# Altium schematic sheet QPB-V1-BlockDiagram.SchDoc: QUAN POWER BOARD VERSION 1
size A4; PageSetup: Record=PageOptions|CenterHorizontal=True|CenterVertical=True|PrintScale=1.00|XCorrection=1.00|YCorrection=1.00|PrintKind=0|BorderSize=5000000|LeftOffset=0|BottomOffset=0|Orientation=2|PaperLength=1000|PaperWidth=1000|Scale=100|PaperSource=7|PrintQuality=-4|MediaType=1|DitherType=10|PaperKind=A4|PrintScaleMode=1
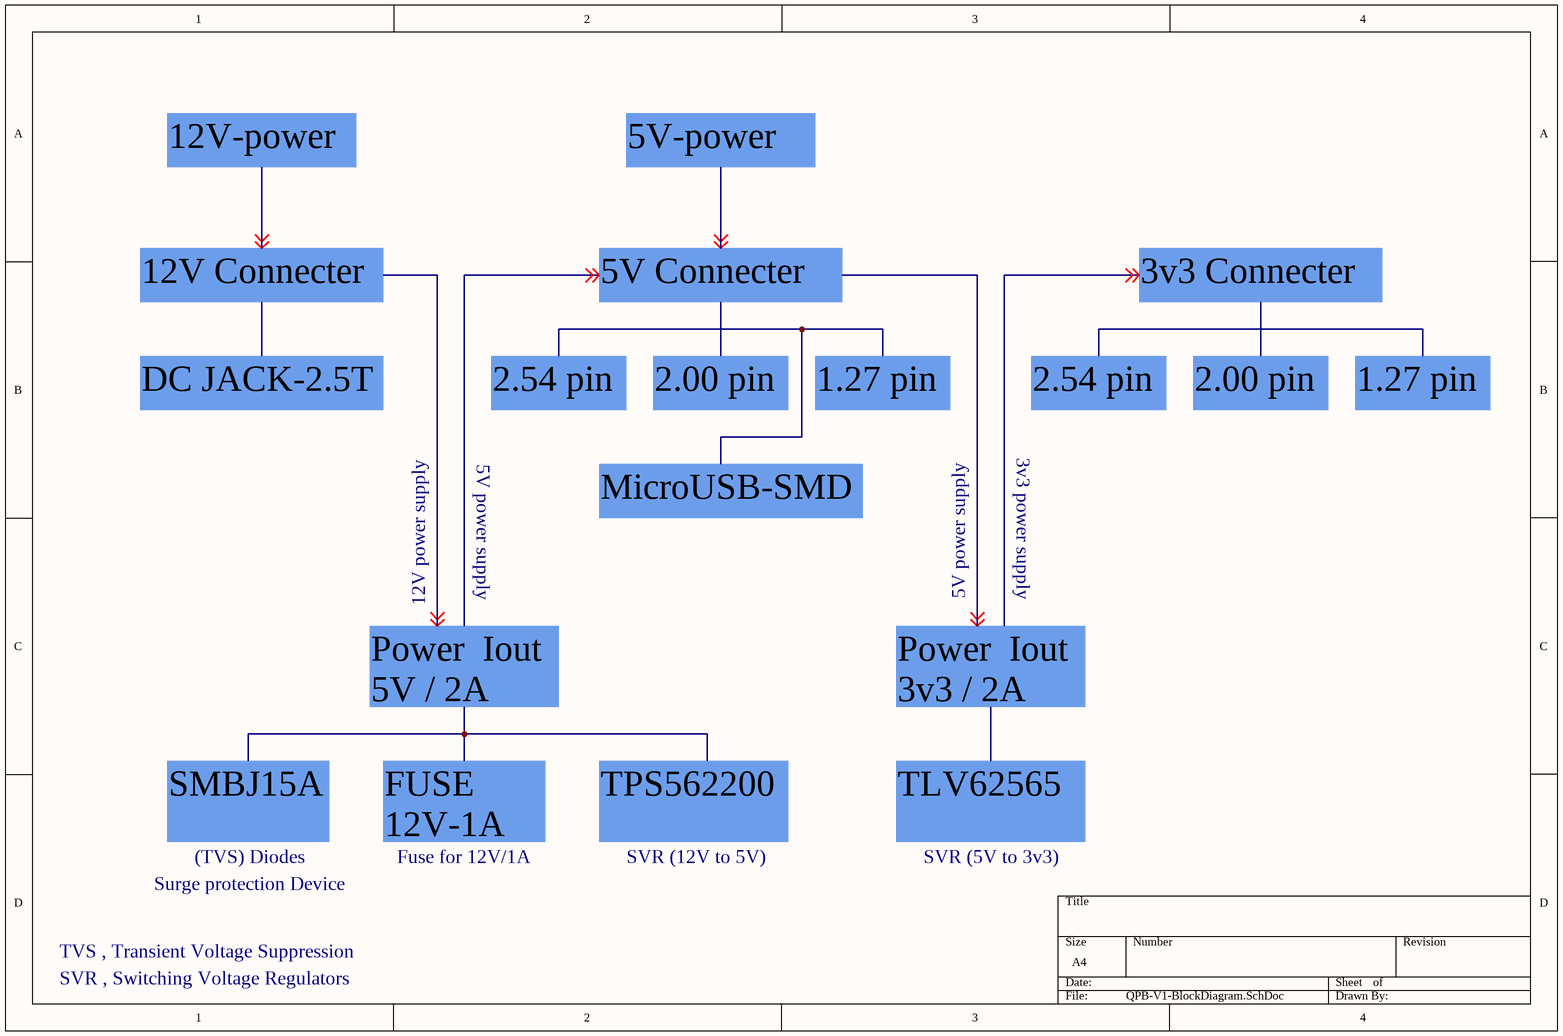
[diagram p0: QPB-V1-BlockDiagram.SchDoc]

## Notes on the sheet
- 12V-power
- 5V-power
- 12V Connecter
- 5V Connecter
- 3v3 Connecter
- DC JACK-2.5T
- 2.54 pin
- 2.00 pin
- 1.27 pin
- 5V power supply
- MicroUSB-SMD
- 3v3 power supply
- 12V power supply
- Power  Iout
  5V / 2A
- Power  Iout
  3v3 / 2A
- SMBJ15A
- FUSE
  12V-1A
- TPS562200
- TLV62565
- Surge protection Device
- (TVS) Diodes
- Fuse for 12V/1A
- SVR (12V to 5V)
- SVR (5V to 3v3)
- TVS , Transient Voltage Suppression
- SVR , Switching Voltage Regulators